# Altium schematic sheet Aux_Inputs.SchDoc: RP2040 CNC
size B; Author: AM; CompanyName: Expatria Technologies; DrawnBy: A.Marles; Engineer: AM; Organization: Expatria Technolgoies; DocumentNumber: 7; SheetNumber: 7; SheetTotal: 14
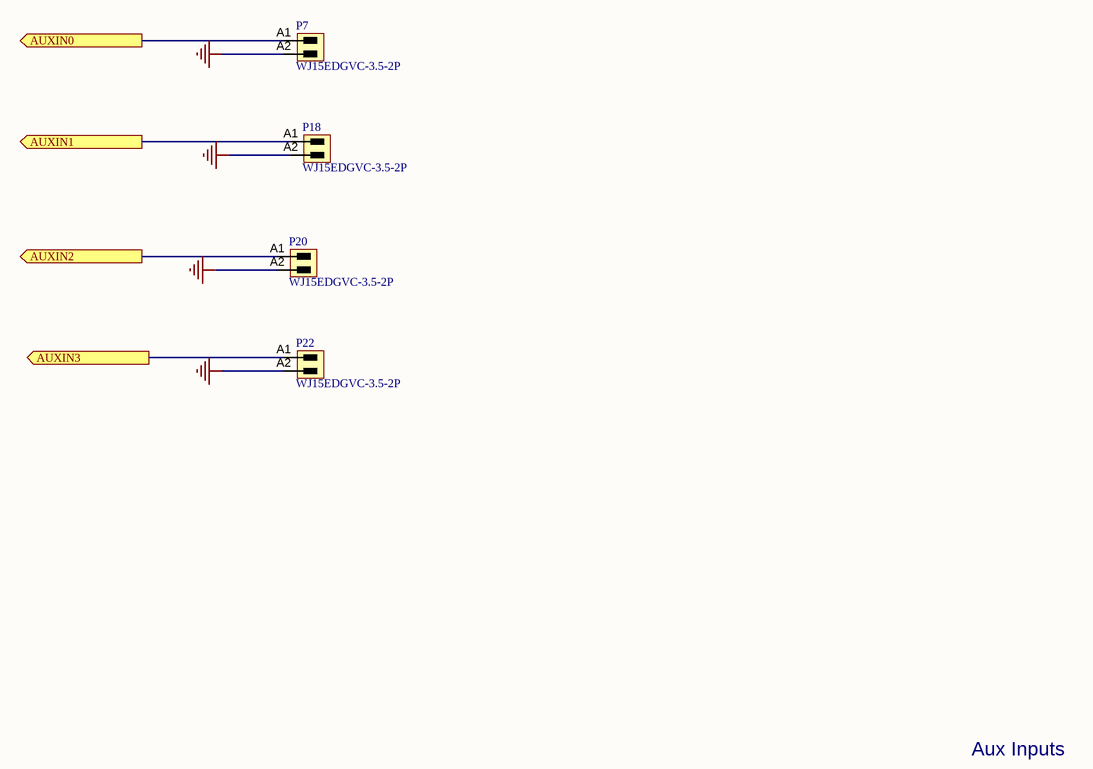
[diagram p0: Aux_Inputs.SchDoc]

## Parts
P7  WJ15EDGVC-3.5-2P  [691321100002]
P18  WJ15EDGVC-3.5-2P  [691321100002]
P20  WJ15EDGVC-3.5-2P  [691321100002]
P22  WJ15EDGVC-3.5-2P  [691321100002]

## Ports
AUXIN0 (out), AUXIN1 (out), AUXIN2 (out), AUXIN3 (out)

## Nets
GND: P7.A2 P18.A2 P20.A2 P22.A2
AUXIN0: P7.A1 ; port AUXIN0
AUXIN1: P18.A1 ; port AUXIN1
AUXIN2: P20.A1 ; port AUXIN2
AUXIN3: P22.A1 ; port AUXIN3

## Notes on the sheet
- Aux Inputs
- SHEET
- Expatria Technologies
- 1136 Glade Court
- Port Coquitlam, BC V3B 1R5
- PROJECT
- SIZE
- ENGR
- MODIFIED
- DOCUMENT
- REV
- Copyright Expatria Technologies 2022. This document describes Open Hardware and is licensed under the CERN-OHL-S v2. No warranty is implied or expressed.
- EMAIL: INFO@EXPATRIA.CA
- B
- /

## Library data of the parts
P7 P18 P20 P22 = 3.5mm Terminal Header 2p: Header,Male Pin,Covered(4 Sided) 2 1 0.138"（3.50mm） 2 P=3.5mm Pluggable System Terminal Block RoHS; Manufacturer: Weidmueller; Manufacturer 1: Weidmuller; Manufacturer Part Number 1: 1604470000; UL_94_flammability_rating: V-0; Pitch_mm: 3.5 mm; Side_termination_characteristic: closed side; Pitch_inch: 0.138 inch; Solder_pin_length_mm: 3.2 mm; Short_text_for_material: SL 3.50/02/180G 3.2SN OR BX; ComponentLink1Description: Manufacturer URL; ComponentLink1URL: http://www.weidmueller.com/; PartNumber: WJ15EDGVC-3.5-2P; Revision: V1; PackageReference: SL_3_50_180G_02; Packaging: Box; SuppliersPartNumber: C192777